# EAGLE schematic FLIGHTCOMPUTER_PCB_AIRBRAKE (EAGLE 9.7.0)
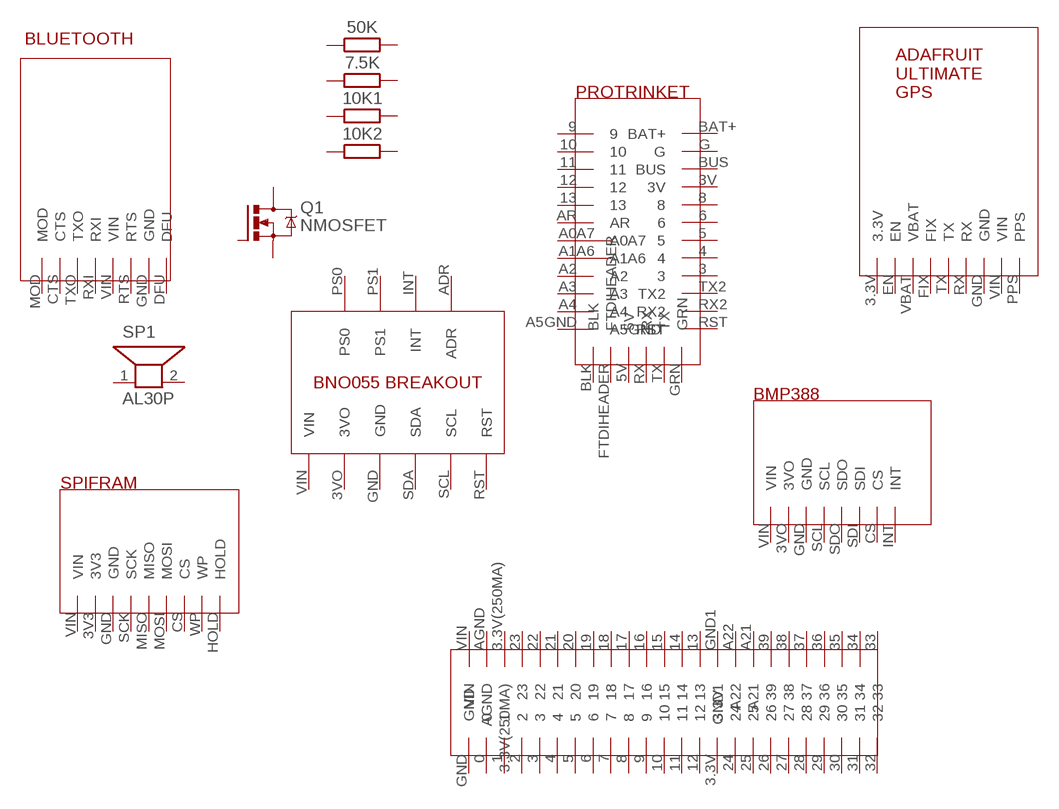
[diagram p0: schematic, sheet 1]

## Parts
7.5K  R_AXIAL-7.2MM-PITCH  [RESAD724W46L381D178B]
10K1  R_AXIAL-7.2MM-PITCH  [RESAD724W46L381D178B]
10K2  R_AXIAL-7.2MM-PITCH  [RESAD724W46L381D178B]
50K  R_AXIAL-7.2MM-PITCH  [RESAD724W46L381D178B]
Q1  NMOSFET  NMOSFET_TO220  [TO220BV]
SP1  AL30P  [AL30P]
U$1  PROTRINKET  [PROTRINKET]
U$2  BMP388  [BMP388]
U$3  TEENSY4.1  [TEENSY4.1]
U$4  BNO055_BREAKOUT  [BNO055_BREAKOUT_FOOTPRINT]
U$5  ADAFRUIT_ULTIMATE_GPS  [ADAFRUIT_ULTIMATE_GPS]
U$6  SPIFRAM  [SPIFRAM]
U$7  BLUETOOTH  [BLUETOOTH]
Unconnected: 7.5K.1 7.5K.2 10K1.1 10K1.2 10K2.1 10K2.2 50K.1 50K.2 Q1.D Q1.G Q1.S SP1.1 SP1.2 U$1.3 U$1.3V U$1.4 U$1.5 U$1.5V U$1.6 U$1.8 U$1.9 U$1.10 U$1.11 U$1.12 U$1.13 U$1.A0 U$1.A1 U$1.A2 U$1.A3 U$1.A4 U$1.A5GND U$1.A6 U$1.A7 U$1.AR U$1.BAT+ U$1.BLK U$1.BUS U$1.FTDIHEADER U$1.G U$1.GRN U$1.RST U$1.RX U$1.RX2 U$1.TX U$1.TX2 U$2.3VO U$2.CS U$2.GND U$2.INT U$2.SCL U$2.SDI U$2.SDO U$2.VIN U$3.0 U$3.1 U$3.2 U$3.3 U$3.3.3V U$3.3.3V(250MA) U$3.4 U$3.5 U$3.6 U$3.7 U$3.8 U$3.9 U$3.10 U$3.11 U$3.12 U$3.13 U$3.14 U$3.15 U$3.16 U$3.17 U$3.18 U$3.19 U$3.20 U$3.21 U$3.22 U$3.23 U$3.24 U$3.25 U$3.26 U$3.27 U$3.28 U$3.29 U$3.30 U$3.31 U$3.32 U$3.33 U$3.34 U$3.35 U$3.36 U$3.37 U$3.38 U$3.39 U$3.A21 U$3.A22 U$3.AGND U$3.GND U$3.GND1 U$3.VIN U$4.3VO U$4.ADR U$4.GND U$4.INT U$4.PS0 U$4.PS1 U$4.RST U$4.SCL U$4.SDA U$4.VIN U$5.3.3V U$5.EN U$5.FIX U$5.GND U$5.PPS U$5.RX U$5.TX U$5.VBAT U$5.VIN U$6.3V3 U$6.CS U$6.GND U$6.HOLD U$6.MISO U$6.MOSI U$6.SCK U$6.VIN U$6.WP U$7.CTS U$7.DFU U$7.GND U$7.MOD U$7.RTS U$7.RXI U$7.TXO U$7.VIN

## Library data of the parts
7.5K 10K1 10K2 50K = Resistor:R: Resistor Fixed - Generic; CATEGORY: Resistor; SUB-CATEGORY: Fixed
Q1 = Transistor:NMOSFET: N-Channel MOSFET - Generic; CATEGORY: Transistor; SUB-CATEGORY: MOSFET; TYPE: N-Channel
SP1 = buzzer:AL30P: SPEAKER Source: Buerklin; OC_FARNELL: unknown; OC_NEWARK: unknown
U$1 = PROTRINKET.homemade:PROTRINKET
U$2 = BMP388:BMP388
U$3 = Avionics Library:TEENSY4.1
U$4 = Avionics Library:BNO055_BREAKOUT
U$5 = Payload Library:ADAFRUIT_ULTIMATE_GPS
U$6 = SPIFRAM:SPIFRAM
U$7 = BLUETOOTH:BLUETOOTH